# EAGLE schematic I2C (EAGLE 9.6.2)
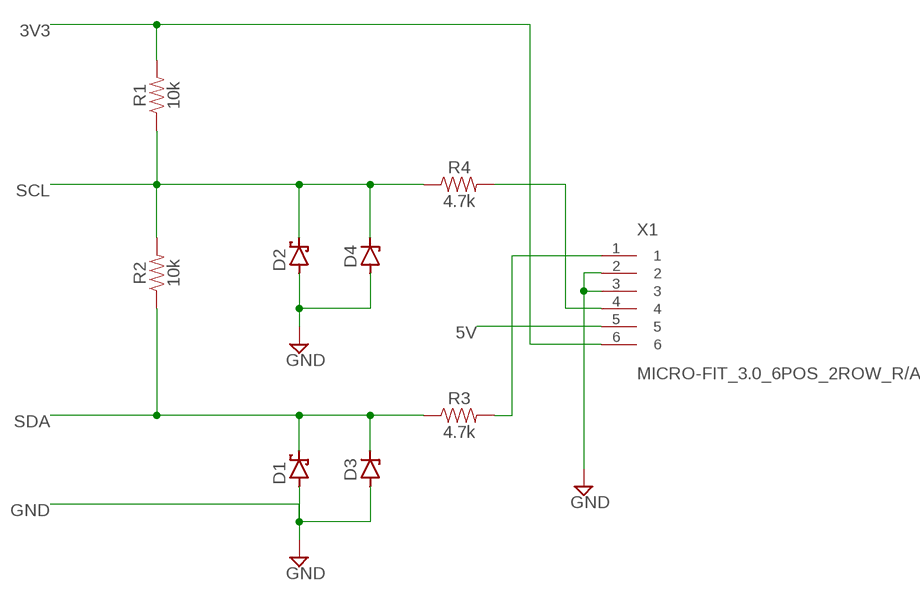
[diagram p0: schematic, sheet 1]

## Parts
D1  SCHOTTKY-DIODESMD  [SMB]
D2  SCHOTTKY-DIODESMD  [SMB]
D3  ZENER-DIODESOT23  [SOT23]
D4  ZENER-DIODESOT23  [SOT23]
R1  10k  RES-10KOHM-0603-1/10W-1%  [R0603]
R2  10k  RES-10KOHM-0603-1/10W-1%  [R0603]
R3  4.7k  RES-4.7KOHM-0603-1/10W-1%  [R0603]
R4  4.7k  RES-4.7KOHM-0603-1/10W-1%  [R0603]
X1  MICRO-FIT_3.0_6POS_2ROW_R/A  [0430450600]

## Nets
3V3: R1.2 X1.6
5V: X1.5
GND: D1.A D2.A D3.1(A) D4.1(A) X1.2 X1.3
N$5: R4.2 X1.4
N$6: R3.2 X1.1
SCL: D2.C D4.3(C) R1.1 R2.2 R4.1
SDA: D1.C D3.3(C) R2.1 R3.1

## Library data of the parts
D1 D2 = diode:SCHOTTKY-DIODE: Schottky Diode
D3 D4 = diode:ZENER-DIODE: Z-Diode
R1 R2 = gtsr-passive:RES-10KOHM; MANUFACTURER: Panasonic; MFPN: ERJ-3EKF1002V; SUPPLIER: Digikey; SUPPLIER_PN: P10.0KHCT-ND
R3 R4 = gtsr-passive:RES-4.7KOHM; MANUFACTURER: Panasonic Electronic Components; MFPN: ERJ-3EKF4701V; SUPPLIER: Digi-Key; SUPPLIER_PN: P4.70KHCT-ND
X1 = gtsr-connector:MICRO-FIT_3.0_6POS; MANUFACTURER: Molex; MFPN: 0430450600; SUPPLIER: Digi-Key; SUPPLIER_PN: WM1815-ND